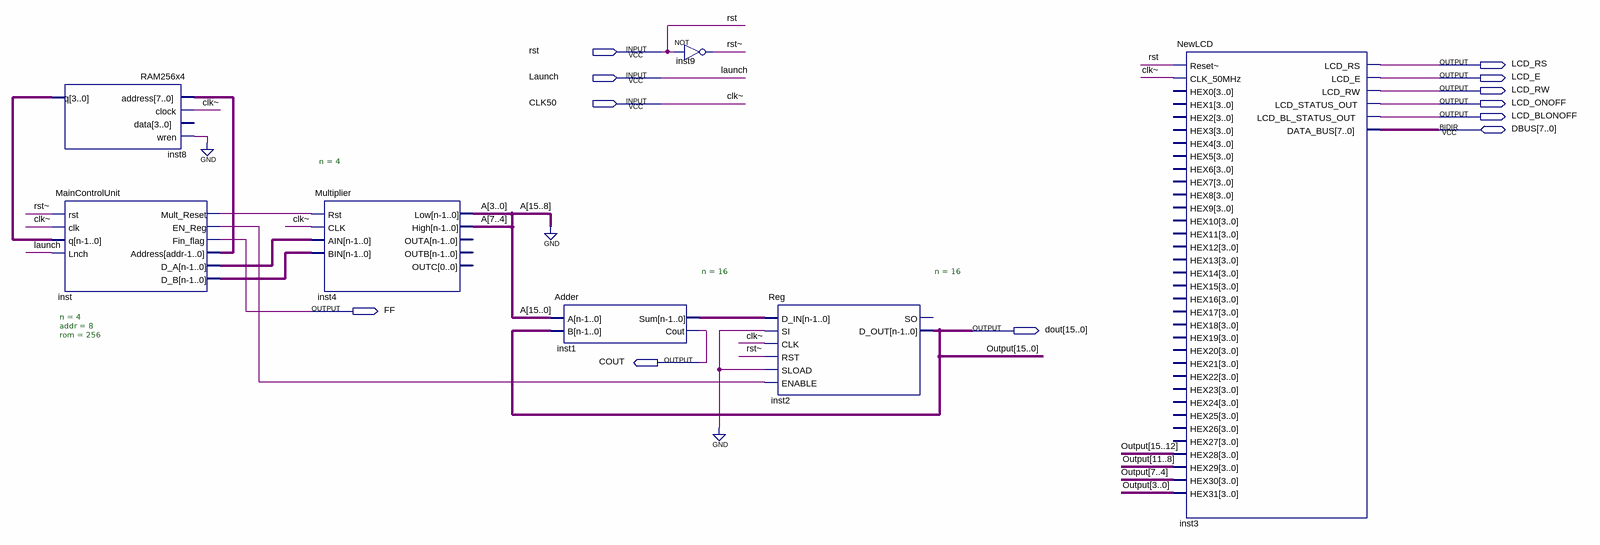
[diagram p0: schematic sheet]
// Quartus schematic Vector_multiplier_sum.bdf as structural Verilog: 7 symbols, 12 pins
module Vector_multiplier_sum (
  input  rst,
  input  Launch,
  input  CLK50,
  inout  [7:0] DBUS,
  output LCD_RS,
  output LCD_E,
  output LCD_RW,
  output LCD_ONOFF,
  output LCD_BLONOFF,
  output FF,
  output [15:0] dout,
  output COUT
);

  wire inst_en_reg, inst_mult_reset, \rst~ ;
  wire [3:0] inst8_q, inst_d_a, inst_d_b;
  wire [7:0] A, inst_address;
  wire [15:0] inst1_sum;

  RAM256x4 inst8 (.address(inst_address), .clock(CLK50), .wren(1'b0), .q(inst8_q));  // open: data
  MainControlUnit #(.n(4), .addr(8), .rom(256)) inst (
    .rst(\rst~ ), .clk(CLK50), .q(inst8_q), .Lnch(Launch), .Mult_Reset(inst_mult_reset),
    .EN_Reg(inst_en_reg), .Fin_flag(FF), .Address(inst_address), .D_A(inst_d_a), .D_B(inst_d_b));
  Multiplier #(.n(4)) inst4 (
    .Rst(inst_mult_reset), .CLK(CLK50), .AIN(inst_d_a), .BIN(inst_d_b), .Low(A[3:0]), .High(A[7:4]));  // open: OUTA, OUTB, OUTC
  Adder #(.n(16)) inst1 (.A({{8{1'b0}}, A}), .B(dout), .Sum(inst1_sum), .Cout(COUT));
  not inst9 (\rst~ , rst);
  Reg #(.n(16)) inst2 (
    .D_IN(inst1_sum), .SI(1'b0), .CLK(CLK50), .RST(\rst~ ), .SLOAD(1'b0), .ENABLE(inst_en_reg), .D_OUT(dout));  // open: SO
  NewLCD inst3 (
    .\Reset~ (rst), .CLK_50MHz(CLK50), .HEX28(dout[15:12]), .HEX29(dout[11:8]), .HEX30(dout[7:4]),
    .HEX31(dout[3:0]), .LCD_RS(LCD_RS), .LCD_E(LCD_E), .LCD_RW(LCD_RW), .LCD_STATUS_OUT(LCD_ONOFF),
    .LCD_BL_STATUS_OUT(LCD_BLONOFF), .DATA_BUS(DBUS));  // open: HEX0, HEX1, HEX2, HEX3, HEX4, HEX5, HEX6, HEX7, HEX8, HEX9, HEX10, HEX11, HEX12, HEX13, HEX14, HEX15, HEX16, HEX17, HEX18, HEX19, HEX20, HEX21, HEX22, HEX23, HEX24, HEX25, HEX26, HEX27

  // Other names for the same wires on the sheet: clk~ = CLK50; Output[15:0] = dout
endmodule
